# EAGLE design robot_simple (EAGLE 6.5.0)
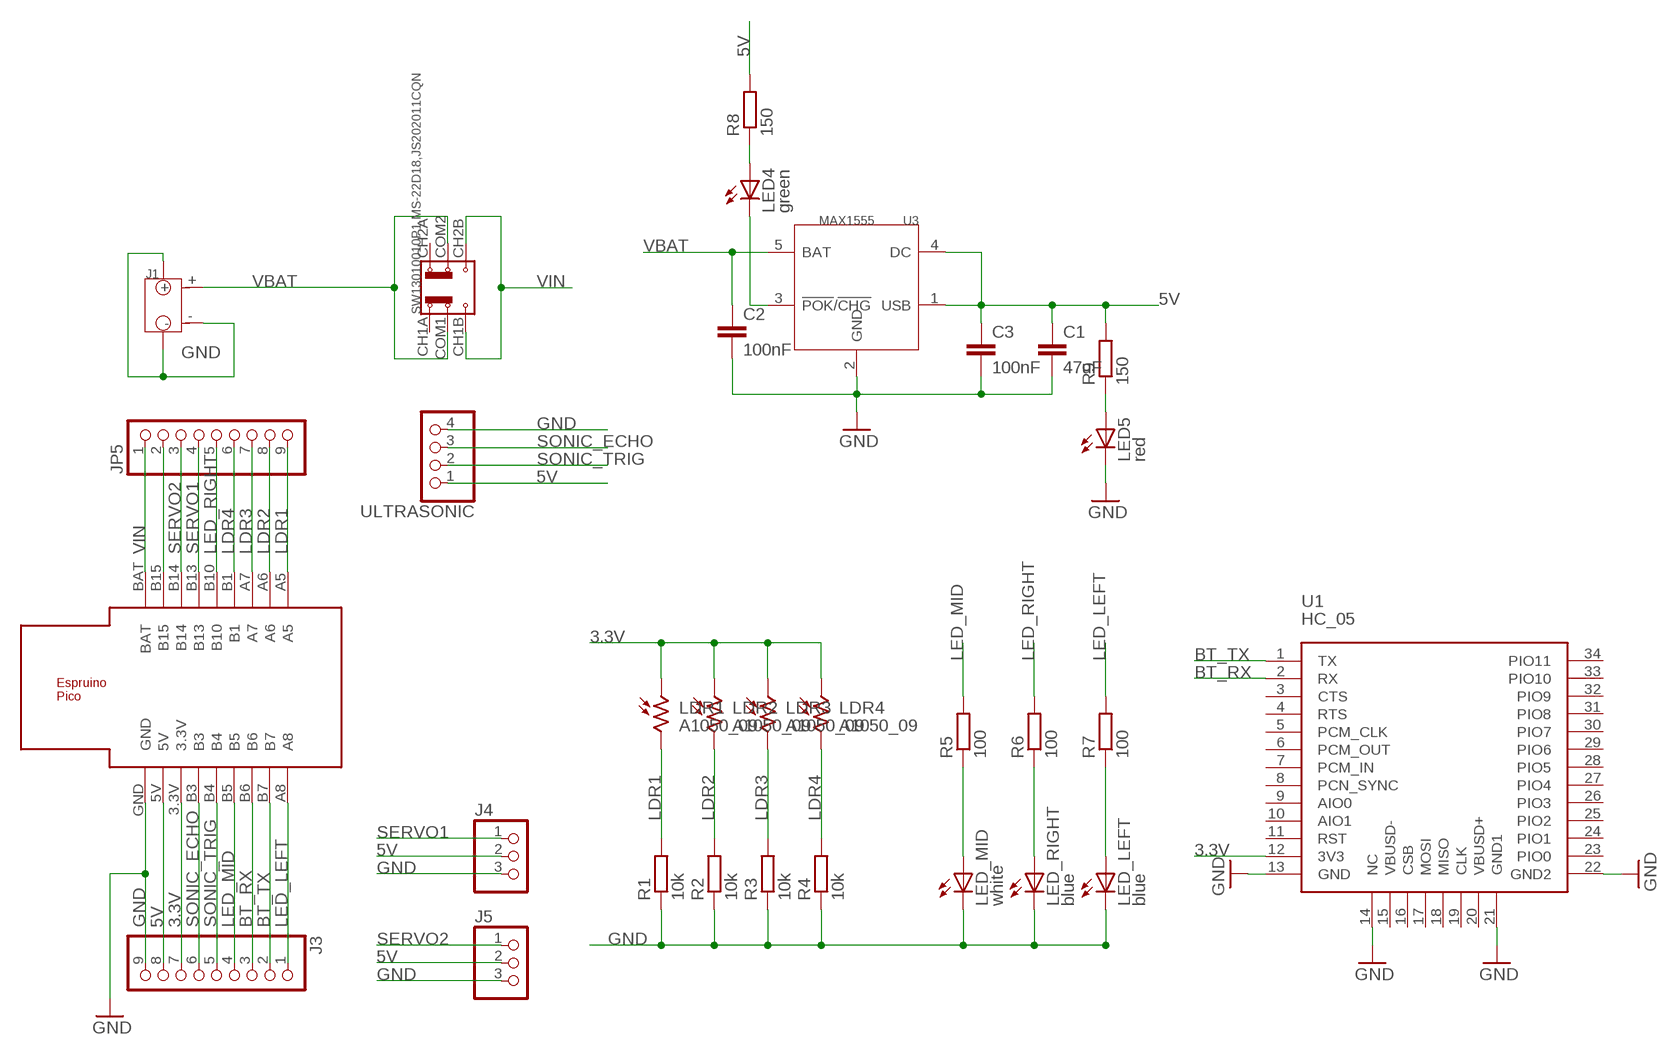
[diagram p0: schematic, sheet 1]

## Parts
C1  47uF  C-EUC1210  [C1210]
C2  100nF  C-EUC0805  [C0805]
C3  100nF  C-EUC0805  [C0805]
J1  JST-2P-SMD-PW-3410050P1  [2P-SMD-2.0-90D]
J3  PINHD-1X9  [1X09]
J4  PINHD-1X3  [1X03]
J5  PINHD-1X3  [1X03]
JP5  PINHD-1X9  [1X09]
LDR1  A1050_09  [T0-46-A10XX]
LDR2  A1050_09  [T0-46-A10XX]
LDR3  A1050_09  [T0-46-A10XX]
LDR4  A1050_09  [T0-46-A10XX]
LED4  green  LEDCHIP-LED0805  [CHIP-LED0805]
LED5  red  LEDCHIP-LED0805  [CHIP-LED0805]
LED_LEFT  blue  LEDCHIP-LED0805  [CHIP-LED0805]
LED_MID  white  LED10MM  [LED10MM]
LED_RIGHT  blue  LEDCHIP-LED0805  [CHIP-LED0805]
R1  10k  R-EU_R0805  [R0805]
R2  10k  R-EU_R0805  [R0805]
R3  10k  R-EU_R0805  [R0805]
R4  10k  R-EU_R0805  [R0805]
R5  100  R-EU_R0805  [R0805]
R6  100  R-EU_R0805  [R0805]
R7  100  R-EU_R0805  [R0805]
R8  150  R-EU_R0805  [R0805]
R9  150  R-EU_R0805  [R0805]
SW1  3010010P1,MS-22D18,JS202011CQN  SWITCH-2CH-6P-3010010P1  [6P-2CH-2.54-9.1X3.5X3.2+2H]
U1  HC_05  [BLUETOOTH_SMD]
U3  MAX1555  MAX1551  [SOT23-5]
U$1  ESPRUINO_PICO_0.1  [ESPRUINO_PICO_0.1]
ULTRASONIC  PINHD-1X4  [1X04]

## Nets
3.3V [power]: J3.7 LDR1.1 LDR2.1 LDR3.1 LDR4.1 U1.12(3V3) U$1.3.3V
5V [power]: C1.1 C3.1 J3.8 J4.2 J5.2 R8.2 R9.2 U3.1(USB) U3.4(DC) U$1.5V ULTRASONIC.1
BT_RX: J3.3 U1.2(RX) U$1.B6
BT_TX: J3.2 U1.1(TX) U$1.B7
GND [power]: C1.2 C2.2 C3.2 J1.3 J1.4 J1.- J3.9 J4.3 J5.3 LED5.C LED_LEFT.C LED_MID.K(C) LED_RIGHT.C R1.1 R2.1 R3.1 R4.1 U1.13(GND) U1.14(NC) U1.21(GND1) U1.22(GND2) U3.2(GND) U$1.GND ULTRASONIC.4
LDR1: JP5.9 LDR1.2 R1.2 U$1.A5
LDR2: JP5.8 LDR2.2 R2.2 U$1.A6
LDR3: JP5.7 LDR3.2 R3.2 U$1.A7
LDR4: JP5.6 LDR4.2 R4.2 U$1.B1
LED_LEFT [power]: J3.1 R7.2 U$1.A8
LED_MID [power]: J3.4 R5.2 U$1.B5
LED_RIGHT [power]: JP5.5 R6.2 U$1.B10
N$2: JP5.2 U$1.B15
N$5: LED_LEFT.A R7.1
N$7: LED_RIGHT.A R6.1
N$9: LED_MID.A R5.1
N$13: LED4.C U3.3(!POK!/!CHG!)
N$14: LED4.A R8.1
N$15: LED5.A R9.1
SERVO1: J4.1 JP5.4 U$1.B13
SERVO2: J5.1 JP5.3 U$1.B14
SONIC_ECHO: J3.6 U$1.B3 ULTRASONIC.3
SONIC_TRIG: J3.5 U$1.B4 ULTRASONIC.2
VBAT [power]: C2.1 J1.+ SW1.COM1 SW1.COM2 U3.5(BAT)
VIN [power]: JP5.1 SW1.CH1B SW1.CH2B U$1.BAT
Unconnected: SW1.CH1A SW1.CH2A U1.3(CTS) U1.4(RTS) U1.5(PCM_CLK) U1.6(PCM_OUT) U1.7(PCM_IN) U1.8(PCN_SYNC) U1.9(AIO0) U1.10(AIO1) U1.11(RST) U1.15(VBUSD-) U1.16(CSB) U1.17(MOSI) U1.18(MISO) U1.19(CLK) U1.20(VBUSD+) U1.23(PIO0) U1.24(PIO1) U1.25(PIO2) U1.26(PIO3) U1.27(PIO4) U1.28(PIO5) U1.29(PIO6) U1.30(PIO7) U1.31(PIO8) U1.32(PIO9) U1.33(PIO10) U1.34(PIO11)

## Library data of the parts
C1-C3 = rcl:C-EU: CAPACITOR, European symbol
J1 = OPL5:JST-2P-SMD-PW
J3 JP5 = pinhead:PINHD-1X9: PIN HEADER
J4 J5 = pinhead:PINHD-1X3: PIN HEADER
LDR1-LDR4 = photo-elements:A10: Sensor Robust Light Sensing Applications Outdoor Light Sensing Application Source: http://optoelectronics.perkinelmer.com/content/Datasheets/DTS_PhotocellsA1050.pdf
LED4 LED5 LED_LEFT LED_MID LED_RIGHT = led:LED: LED OSRAM: - CHIPLED LG R971, LG N971, LY N971, LG Q971, LY Q971, LO R971, LY R971 LH N974, LH R974 LS Q976, LO Q976, LY Q976 LO Q996 - Hyper CHIPLED LW Q18S LB Q993, LB Q99A, LB R99A - SideLED LS A670, LO A670, LY A670, LG A670, LP A670 LB A673, LV A673, LT A673, LW A673 LH A674 LY A675 LS A676, LA A676, LO A676, LY A676, LW A676 LS A679, LY A679, LG A679 - Hyper Micro SIDELED® LS Y876, LA Y876, LO Y876, LY Y876 LT Y87S - SmartLED LW L88C, LW L88S LB L89C, LB L89S, LG L890 LS L89K, LO L89K, LY L89K LS L896, LA L896, LO L896, LY L896 - TOPLED LS T670, LO T670, LY T670, LG T670, LP T670 LSG T670, LSP T670, LSY T670, LOP T670, LYG T670 LG T671, LOG T671, LSG T671 LB T673, LV T673, LT T673, LW T673 LH T674 LS T676, LA T676, LO T676, LY T676, LB T676, LH T676, LSB T676, LW T676 LB T67C, LV T67C, LT T67C, LS T67K, LO T67K, LY T67K, LW E67C LS E67B, LA E67B, LO E67B, LY E67B, LB E67C, LV E67C, LT E67C LW T67C LS T679, LY T679, LG T679 LS T770, LO T770, LY T770, LG T770, LP T770 LB T773, LV T773, LT T773, LW T773 LH T774 LS E675, LA E675, LY E675, LS T675 LS T776, LA T776, LO T776, LY T776, LB T776 LHGB T686 LT T68C, LB T68C - Hyper Mini TOPLED® LB M676 - Mini TOPLED Santana® LG M470 LS M47K, LO M47K, LY M47K Source: http://www.osram.convergy.de LUXEON: - LUMILED® LXK2-PW12-R00, LXK2-PW12-S00, LXK2-PW14-U00, LXK2-PW14-V00 LXK2-PM12-R00, LXK2-PM12-S00, LXK2-PM14-U00 LXK2-PE12-Q00, LXK2-PE12-R00, LXK2-PE12-S00, LXK2-PE14-T00, LXK2-PE14-U00 LXK2-PB12-K00, LXK2-PB12-L00, LXK2-PB12-M00, LXK2-PB14-N00, LXK2-PB14-P00, LXK2-PB14-Q00 LXK2-PR12-L00, LXK2-PR12-M00, LXK2-PR14-Q00, LXK2-PR14-R00 LXK2-PD12-Q00, LXK2-PD12-R00, LXK2-PD12-S00 LXK2-PH12-R00, LXK2-PH12-S00 LXK2-PL12-P00, LXK2-PL12-Q00, LXK2-PL12-R00 Source: www.luxeon.com KINGBRIGHT: KA-3528ASYC Source: www.kingbright.com
R1-R9 = rcl:R-EU_: RESISTOR, European symbol
SW1 = OPL Eagle Library:SWITCH-2CH-6P*: MS-22D18 G2 ROHS
U1 = bluetooth:HC_05
U3 = template:MAX1551: SOT23 Dual-Input USB/AC Adapter 1-Cell Li+ Battery Chargers
U$1 = espruino_pico:ESPRUINO_PICO_0.1
ULTRASONIC = pinhead:PINHD-1X4: PIN HEADER

## Net classes
0 default: width 0.305 mm
1 power: width 0.406 mm

## Board
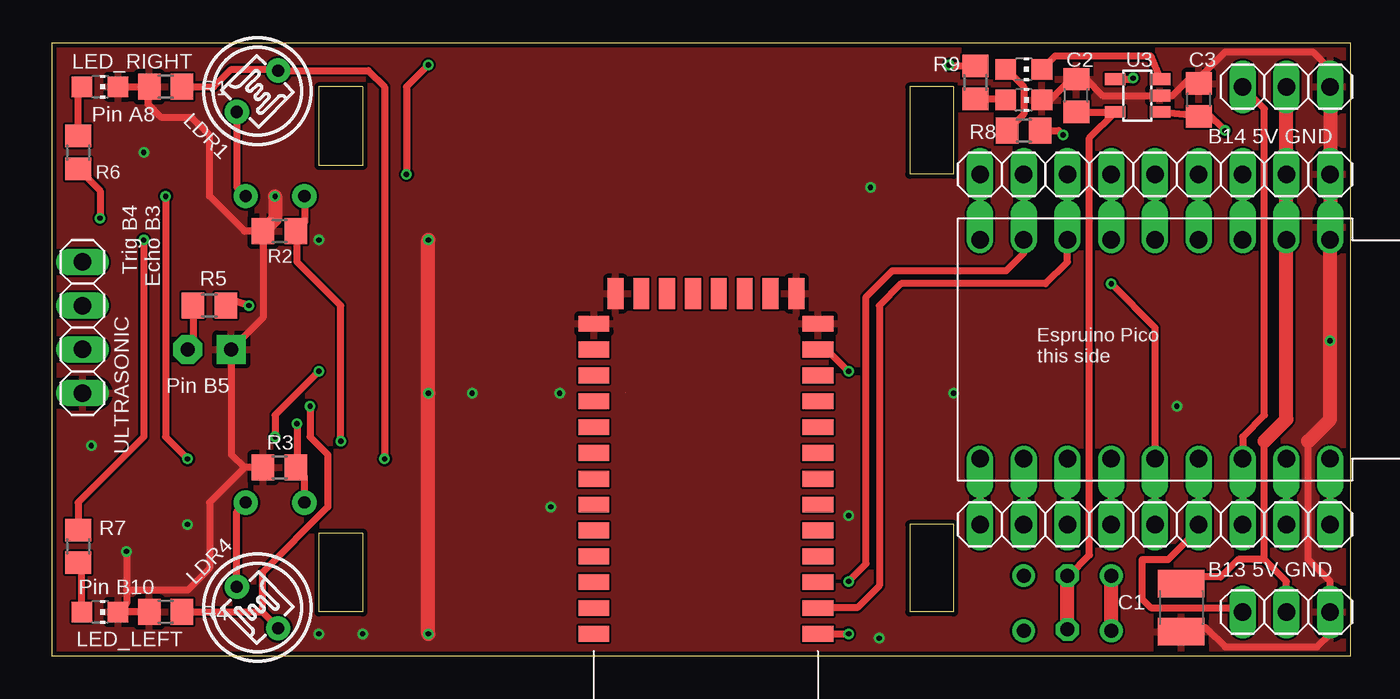
[diagram p1: board, top side]
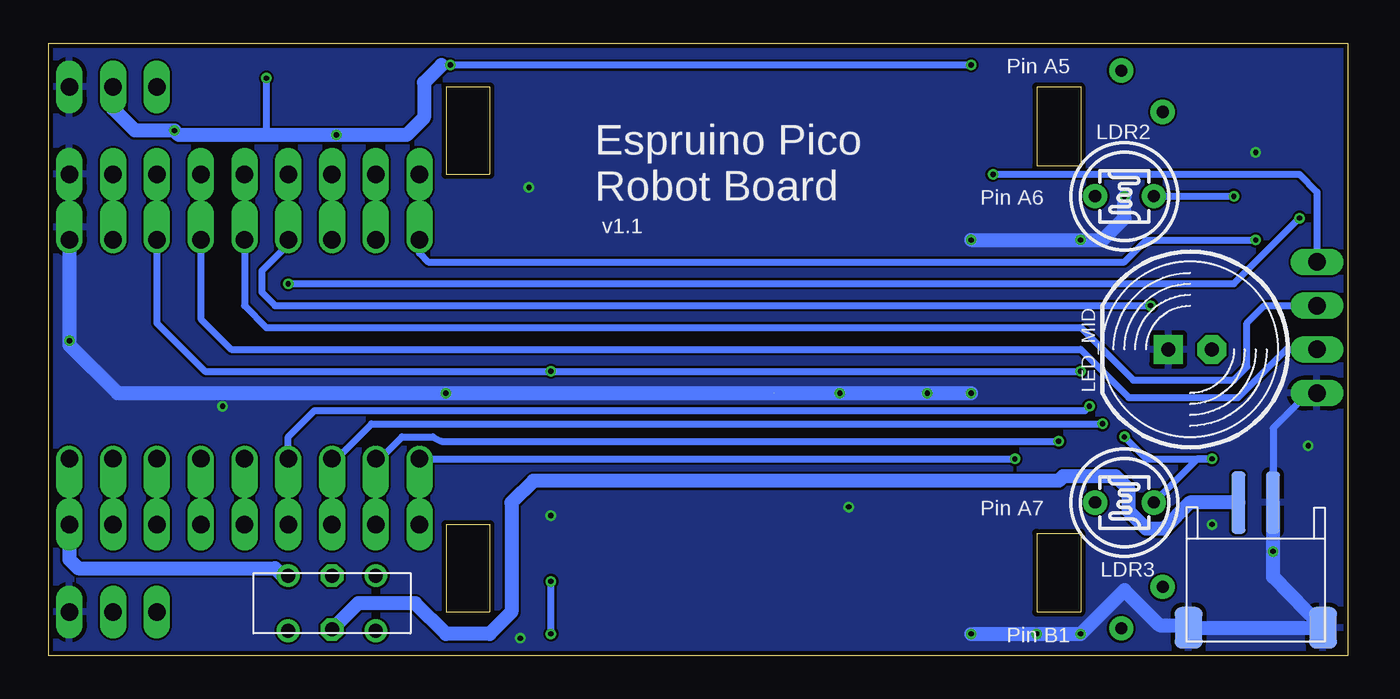
[diagram p2: board, bottom side, seen from below]

Size 75.36 x 35.56 mm. Coordinates in mm from the lower left corner, seen from the top.
Outline: 0,0 75.36,0 75.36,35.55 0,35.56 0,0
Outline: 52.32,27.94 49.78,27.94 49.78,33.02 52.32,33.02 52.32,27.94
Outline: 52.32,2.54 49.78,2.54 49.78,7.62 52.32,7.62 52.32,2.54
Outline: 18.03,33.02 18.03,28.45 15.49,28.45 15.49,33.02 18.03,33.02
Outline: 18.03,7.11 18.03,2.54 15.49,2.54 15.49,7.11 18.03,7.11
Copper layers (1*16): Top 0.035mm / dielectric 1.5mm / Bottom 0.035mm
Design rules "dirt_cheap_dirty_boards.v1": minimum track width 5mil, minimum drill 12mil, track to track 5mil, track to pad 5mil, pad to pad 5mil, via to via 5mil, smd to smd 0mil, copper to edge 10mil, drill to drill 10mil, minimum pad ring 10mil, minimum via ring 6mil, stop-mask expansion 2mil, vias tented up to drill 25mil, thermal gap 10mil

### Footprints (pad centres in the part's own frame; a part is rotated, then mirrored left to right if it is on the bottom)
C1210 = smd 1.6 x 2.7: 1 -1.4,0; 2 1.4,0
C0805 = smd 1.3 x 1.5: 1 -0.95,0; 2 0.95,0
2P-SMD-2.0-90D = smd 1.6 x 2.4: 3 3.9,-2.181; 4 -3.9,-2.181 | smd 0.8 x 3.6: + -1,5.08; - 1,5.08
1X09 = drill 1.016 long: 1 -10.16,0; 2 -7.62,0; 3 -5.08,0; 4 -2.54,0; 5 0,0; 6 2.54,0; 7 5.08,0; 8 7.62,0; 9 10.16,0
1X03 = drill 1.016 long: 1 -2.54,0; 2 0,0; 3 2.54,0
T0-46-A10XX = drill 0.7 pad 1.4: 1 -1.7,0; 2 1.7,0
CHIP-LED0805 = smd 1.2 x 1.2: A 0,-1.05; C 0,1.05
LED10MM = drill 0.813 pad 1.676 octagon: A -1.27,0 | drill 0.813 pad 1.676 square: K 1.27,0
R0805 = smd 1.3 x 1.5: 1 -0.95,0; 2 0.95,0
6P-2CH-2.54-9.1X3.5X3.2+2H = drill 0.813 pad 1.27: CH1A -2.54,-1.6; CH1B 2.54,-1.6; CH2A -2.54,1.6; CH2B 2.54,1.6 | drill 0.813 pad 1.27 octagon: COM1 0,-1.6; COM2 0,1.524
BLUETOOTH_SMD = smd 1.778 x 0.914: 1 0,0; 2 0,-1.5; 3 0,-3; 4 0,-4.5; 5 0,-6; 6 0,-7.5; 7 0,-9; 8 0,-10.5; 9 0,-12; 10 0,-13.5; 11 0,-15; 12 0,-16.5; 13 0,-18; 22 13,-18; 23 13,-16.5; 24 13,-15; 25 13,-13.5; 26 13,-12; 27 13,-10.5; 28 13,-9; 29 13,-7.5; 30 13,-6; 31 13,-4.5; 32 13,-3; 33 13,-1.5; 34 13,0 | smd 0.914 x 1.778: 14 1.25,-19.75; 15 2.75,-19.75; 16 4.25,-19.75; 17 5.75,-19.75; 18 7.25,-19.75; 19 8.75,-19.75; 20 10.25,-19.75; 21 11.75,-19.75
SOT23-5 = smd 0.69 x 1.2: 1 -0.95,-1.3; 2 0,-1.3; 3 0.95,-1.3; 4 0.95,1.3; 5 -0.95,1.3
ESPRUINO_PICO_0.1 = drill 1.016 offset: 3.3V -7.62,-6.35; 5V -10.16,-6.35; A5 7.62,6.35; A6 5.08,6.35; A7 2.54,6.35; A8 7.62,-6.35; B1 0,6.35; B3 -5.08,-6.35; B4 -2.54,-6.35; B5 0,-6.35; B6 2.54,-6.35; B7 5.08,-6.35; B10 -2.54,6.35; B13 -5.08,6.35; B14 -7.62,6.35; B15 -10.16,6.35; BAT -12.7,6.35; GND -12.7,-6.35
1X04 = drill 1.016 long: 1 -3.81,0; 2 -1.27,0; 3 1.27,0; 4 3.81,0

### Placement (x,y rotation side)
C1  65.53,2.79 270 top
C2  59.44,32.51 90 top
C3  66.55,32.26 90 top
J1  5.33,3.81 0 bottom
J3  64.01,27.94 0 top
J4  71.63,2.54 0 top
J5  71.63,33.02 0 top
JP5  64.01,7.62 180 top
LDR1  11.94,32.77 45 top
LDR2  12.95,26.67 180 bottom
LDR3  12.95,8.89 180 bottom
LDR4  11.94,2.79 315 top
LED4  56.39,34.04 270 top
LED5  56.39,32.26 270 top
LED_LEFT  2.79,2.54 270 top
LED_MID  9.14,17.78 180 bottom
LED_RIGHT  2.79,33.02 270 top
R1  6.6,33.02 0 top
R2  13.21,24.64 0 top
R3  13.21,10.92 0 top
R4  6.6,2.54 0 top
R5  9.14,20.32 0 top
R6  1.52,29.21 270 top
R7  1.52,6.35 90 top
R8  56.39,30.48 0 top
R9  53.59,33.27 90 top
SW1  58.93,3.05 180 bottom
U1  44.45,1.27 180 top
U3  62.99,32.51 90 top
U$1  61.47,17.78 180 top
ULTRASONIC  1.78,19.05 270 top

### Tracks (layer width: path | path; a pad name or v marks a point on that pad's centre or on a via)
3.3V  (via drill 0.3)
  Top 0.406: LDR4.1 10.74,8.37 LDR3.1 | LDR1.1 10.74,27.19 LDR2.1 | v6.6,26.67 6.6,12.7 v7.87,11.43 | J3.7 U$1.3.3V | v15.49,16.51 12.95,13.97 v12.95,12.7 | U1.12 44.96,17.78 v46.23,16.51
  Bottom 0.406: LDR2.1 v6.6,26.67 | LDR3.1 8.71,11.43 v7.87,11.43 11.68,11.43 v12.95,12.7 | U$1.3.3V 69.09,19.3 66.29,16.51 v46.23,16.51 v15.49,16.51
5V  (via drill 0.3)
  Top 0.406: J4.2 71.63,4.32 70.36,5.59 | 70.36,5.59 70.36,12.45 | 70.36,5.59 68.83,5.59 67.82,4.57 65.66,4.57 C1.1 | U3.1 C3.1 66.99,31.56 v68.07,30.48 | R8.2 58.42,30.48 v58.67,30.23 | R9.2 52.14,34.22 v52.07,34.29 | v21.84,34.29 20.57,33.02 v20.57,27.94 | U3.4 62.67,33.46 v62.74,33.53
  Top 0.813: 70.36,12.45 71.63,13.72 U$1.5V J3.8 J5.2
  Bottom 0.406: 71.63,31.75 J5.2 | 52.58,34.29 v52.07,34.29 v21.84,34.29 | v62.74,33.53 62.74,30.23 | v20.57,27.94 2.79,27.94 1.78,26.92 ULTRASONIC.1
  Bottom 0.813: 71.63,31.75 70.36,30.48 v68.07,30.48 67.82,30.23 62.74,30.23 v58.67,30.23 54.61,30.23 53.59,31.24 53.59,33.27 52.58,34.29
BT_RX
  Top 0.406: J3.3 U$1.B6 58.93,22.86 57.66,21.59 49.28,21.59 48.01,20.32 48.01,4.06 46.74,2.79 44.47,2.79 U1.2
BT_TX  (via drill 0.3)
  Top 0.406: J3.2 U$1.B7 56.39,23.37 55.37,22.35 48.77,22.35 47.24,20.83 47.24,5.33 v46.23,4.32 | U1.1 v46.23,1.27
  Bottom 0.406: v46.23,1.27 v46.23,4.32
GND  (via drill 0.3)  (1 unrouted)
  Top 0.406: 72.9,12.45 72.9,5.59 74.17,4.32 J4.3 74.17,1.27 73.41,0.51 68.07,0.51 66.93,1.65 C1.2 | J5.3 74.17,34.04 73.15,35.05 68.07,35.05 66.55,33.53 C3.2 66.48,33.53 66.04,33.53 65.02,32.51 U3.2 60.96,32.51 60.01,33.46 C2.2 59.12,33.46 57.91,32.26 LED5.C | R4.1 LED_LEFT.C 4.33,3.03 4.33,3.81 | LED_RIGHT.C R1.1 5.59,32.95 5.59,32 6.35,31.24 8.13,31.24 9.14,30.23 9.14,26.67 11.18,24.64 R2.1 12.26,19.62 LED_MID.K 10.41,11.68 11.18,10.92 | v4.33,6.05 4.33,3.81 | R3.1 11.18,10.92 | 11.18,10.92 9.14,8.89 9.14,5.08 7.87,3.81 4.33,3.81
  Top 0.813: J5.3 J3.9 U$1.GND 74.17,13.72 72.9,12.45 | v21.84,24.13 v21.84,15.24 v21.84,1.27 | v12.95,26.67 12.95,25.33 R2.1
  Bottom 0.406: ULTRASONIC.4 2.29,15.24 4.32,13.21 4.32,6.1
  Bottom 0.813: J1.- v4.33,6.05 4.33,4.59 4.32,4.57 J1.3 J1.4 | U$1.GND 74.17,18.03 71.37,15.24 v21.84,15.24 | v21.84,24.13 14.22,24.13 12.95,25.4 v12.95,26.67 | v21.84,1.27 v15.49,1.27 12.95,3.81 10.92,1.78 9.14,1.78
  other vias: 74.17,18.29 52.32,15.24 29.46,15.24 24.38,15.24 18.03,1.27 15.49,24.13 65.28,14.48 48.01,1.02 47.5,27.18 2.29,12.19 7.87,7.62 5.33,29.21 46.23,8.13 28.96,8.64
  pour Top: 0,35.56 75.44,35.56 75.69,0 0.25,0
  pour Bottom: 0.25,0 75.69,0 75.44,35.56 0,35.56
LDR1  (via drill 0.3)
  Top 0.406: U$1.A5 JP5.9 | v19.3,11.43 19.3,33.02 18.36,33.97 LDR1.2 13.07,34.04 10.41,34.04 9.4,33.02 R1.2
  Bottom 0.406: U$1.A5 v19.3,11.43
LDR2  (via drill 0.3)
  Top 0.406: U$1.A6 JP5.8 | LDR2.2 14.65,25.13 R2.2 14.22,24.57 14.22,22.86 16.76,20.32 v16.76,12.45
  Bottom 0.406: U$1.A6 56.13,11.43 54.86,12.7 53.09,12.7 52.58,12.45 v16.76,12.45
LDR3  (via drill 0.3)
  Top 0.406: U$1.A7 JP5.7 | LDR3.2 14.65,10.43 R3.2 14.22,10.99 v14.22,13.46
  Bottom 0.406: U$1.A7 58.67,11.43 56.64,13.46 v14.22,13.46
LDR4  (via drill 0.3)
  Top 0.406: R4.2 12.19,2.54 | 12.19,2.54 | 12.19,2.54 LDR4.2 | JP5.6 U$1.B1 | v14.99,14.48 14.99,12.7 16,11.68 16,8.64 12.19,4.83 12.19,2.54
  Bottom 0.406: U$1.B1 61.47,12.7 59.94,14.22 15.24,14.22 v14.99,14.48
LED_LEFT  (via drill 0.3)
  Top 0.406: J3.1 U$1.A8 | v5.33,24.13 5.33,12.7 1.52,8.89 R7.2
  Bottom 0.406: v5.33,24.13 11.68,24.13 12.95,22.86 53.34,22.86 53.85,23.37 U$1.A8
LED_MID  (via drill 0.3)
  Top 0.406: J3.4 U$1.B5 | v11.43,20.32 10.41,20.64 R5.2
  Bottom 0.406: v11.43,20.32 62.23,20.32 62.99,21.08 62.99,22.35 61.47,23.88 U$1.B5
LED_RIGHT  (via drill 0.3)
  Top 0.406: JP5.5 U$1.B10 64.01,19.05 v61.47,21.59 | R6.2 2.79,26.99 v2.79,25.4
  Bottom 0.406: v61.47,21.59 6.6,21.59 v2.79,25.4
N$2
  Top 0.406: U$1.B15 JP5.2
N$5
  Top 0.406: LED_LEFT.A 1.74,5.18 R7.1
N$7
  Top 0.406: R6.1 1.52,32.8 LED_RIGHT.A
N$9
  Top 0.406: R5.1 8.19,18.1 LED_MID.A
N$13
  Top 0.406: U3.3 64.33,33.46 63.75,34.8 58.2,34.8 LED4.C
N$14
  Top 0.406: LED4.A 55.37,34.04 56.39,33.02 56.39,31.43 R8.1
N$15
  Top 0.406: R9.1 55.27,32.32 LED5.A
SERVO1
  Top 0.406: J4.1 68.83,2.79 63.75,2.79 63.25,3.3 63.25,5.59 64.77,5.59 66.29,7.11 66.29,7.37 JP5.4 U$1.B13
SERVO2
  Top 0.406: J5.1 70.36,31.75 70.36,13.97 69.09,12.7 U$1.B14 JP5.3
SONIC_ECHO
  Top 0.406: J3.6 U$1.B3
  Bottom 0.406: U$1.B3 66.55,19.56 64.77,17.78 15.49,17.78 12.7,14.99 6.35,14.99 3.56,17.78 ULTRASONIC.3
SONIC_TRIG
  Top 0.406: J3.5 U$1.B4
  Bottom 0.406: U$1.B4 64.01,20.32 62.74,19.05 15.49,19.05 12.45,16 6.6,16 5.84,16.76 5.84,19.3 4.83,20.32 ULTRASONIC.2
VBAT
  Top 0.406: SW1.COM1 59,4.65 60.2,5.84 60.2,30.07 U3.5 C2.1
  Top 0.813: SW1.COM2 SW1.COM1
  Bottom 0.813: SW1.COM2 57.4,3.05 54.1,3.05 52.32,1.27 49.78,1.27 48.51,2.54 48.51,8.89 47.24,10.16 16.76,10.16 16.51,10.41 13.46,10.41 12.7,9.65 12.7,8.38 11.68,7.37 10.67,7.37 9.14,8.89 J1.+
VIN
  Top 0.406: JP5.1 U$1.BAT
  Top 0.813: SW1.CH2B SW1.CH1B
  Bottom 0.406: 61.54,4.57 SW1.CH1B
  Bottom 0.813: JP5.1 74.17,5.59 73.66,5.08 62.23,5.08 61.72,4.57 61.54,4.57

### Text on the board
tPlace: Trig B4 / Echo B3
bPlace: Pin A5 | Pin A6 | v1.1 | Pin A7 | Pin B1
tNames: Pin A8 | B14 5V GND | Espruino Pico / this side | Pin B5 | B13 5V GND | Pin B10
bNames: Espruino Pico / Robot Board